# EAGLE design led_ring (EAGLE 8.5.2)
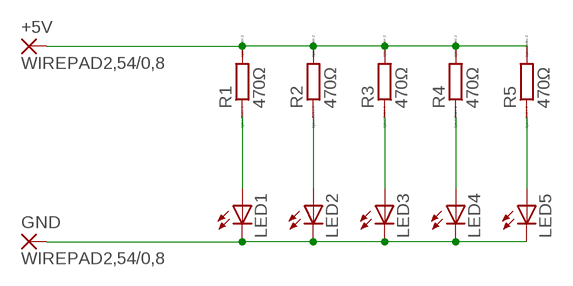
[diagram p0: schematic, sheet 1]

## Parts
+5V  WIREPAD2,54/0,8  [2,54/0,8]
GND  WIREPAD2,54/0,8  [2,54/0,8]
LED1  LED5MM  [LED5MM]
LED2  LED5MM  [LED5MM]
LED3  LED5MM  [LED5MM]
LED4  LED5MM  [LED5MM]
LED5  LED5MM  [LED5MM]
R1  470Ω  R0204/7  [0204/7]
R2  470Ω  R0204/7  [0204/7]
R3  470Ω  R0204/7  [0204/7]
R4  470Ω  R0204/7  [0204/7]
R5  470Ω  R0204/7  [0204/7]

## Nets
N$1: LED1.A R1.1
N$2: LED2.A R2.1
N$3: LED3.A R3.1
N$4: LED4.A R4.1
N$5: LED5.A R5.1
N$6: +5V.1(P) R1.2 R2.2 R3.2 R4.2 R5.2
N$7: GND.1(P) LED1.K(C) LED2.K(C) LED3.K(C) LED4.K(C) LED5.K(C)

## Library data of the parts
+5V GND = wirepad:WIREPAD: Wire PAD connect wire on PCB
LED1-LED5 = led:LED: LED OSRAM: - CHIPLED LG R971, LG N971, LY N971, LG Q971, LY Q971, LO R971, LY R971 LH N974, LH R974 LS Q976, LO Q976, LY Q976 LO Q996 - Hyper CHIPLED LW Q18S LB Q993, LB Q99A, LB R99A - SideLED LS A670, LO A670, LY A670, LG A670, LP A670 LB A673, LV A673, LT A673, LW A673 LH A674 LY A675 LS A676, LA A676, LO A676, LY A676, LW A676 LS A679, LY A679, LG A679 - Hyper Micro SIDELED® LS Y876, LA Y876, LO Y876, LY Y876 LT Y87S - SmartLED LW L88C, LW L88S LB L89C, LB L89S, LG L890 LS L89K, LO L89K, LY L89K LS L896, LA L896, LO L896, LY L896 - TOPLED LS T670, LO T670, LY T670, LG T670, LP T670 LSG T670, LSP T670, LSY T670, LOP T670, LYG T670 LG T671, LOG T671, LSG T671 LB T673, LV T673, LT T673, LW T673 LH T674 LS T676, LA T676, LO T676, LY T676, LB T676, LH T676, LSB T676, LW T676 LB T67C, LV T67C, LT T67C, LS T67K, LO T67K, LY T67K, LW E67C LS E67B, LA E67B, LO E67B, LY E67B, LB E67C, LV E67C, LT E67C LW T67C LS T679, LY T679, LG T679 LS T770, LO T770, LY T770, LG T770, LP T770 LB T773, LV T773, LT T773, LW T773 LH T774 LS E675, LA E675, LY E675, LS T675 LS T776, LA T776, LO T776, LY T776, LB T776 LHGB T686 LT T68C, LB T68C - Hyper Mini TOPLED® LB M676 - Mini TOPLED Santana® LG M470 LS M47K, LO M47K, LY M47K Source: http://www.osram.convergy.de LUXEON: - LUMILED® LXK2-PW12-R00, LXK2-PW12-S00, LXK2-PW14-U00, LXK2-PW14-V00 LXK2-PM12-R00, LXK2-PM12-S00, LXK2-PM14-U00 LXK2-PE12-Q00, LXK2-PE12-R00, LXK2-PE12-S00, LXK2-PE14-T00, LXK2-PE14-U00 LXK2-PB12-K00, LXK2-PB12-L00, LXK2-PB12-M00, LXK2-PB14-N00, LXK2-PB14-P00, LXK2-PB14-Q00 LXK2-PR12-L00, LXK2-PR12-M00, LXK2-PR14-Q00, LXK2-PR14-R00 LXK2-PD12-Q00, LXK2-PD12-R00, LXK2-PD12-S00 LXK2-PH12-R00, LXK2-PH12-S00 LXK2-PL12-P00, LXK2-PL12-Q00, LXK2-PL12-R00 Source: www.luxeon.com KINGBRIGHT: KA-3528ASYC Source: www.kingbright.com
R1-R5 = eagle-ltspice:R: RESISTOR, European symbol; SPICEMODEL: NONE; SPICEPREFIX: R

## Board
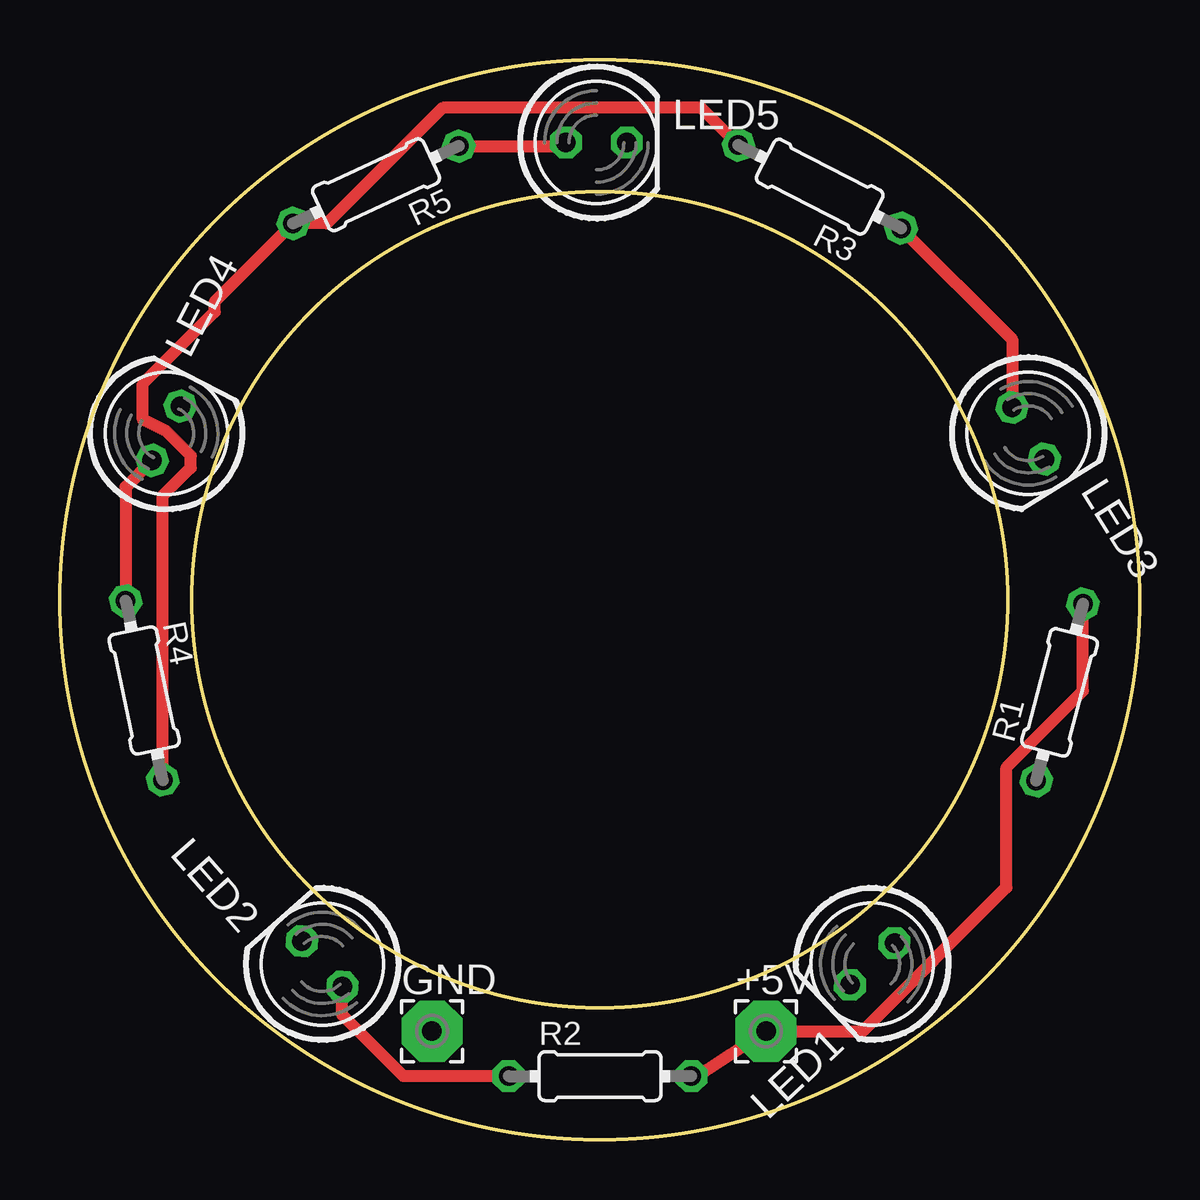
[diagram p1: board, top side]
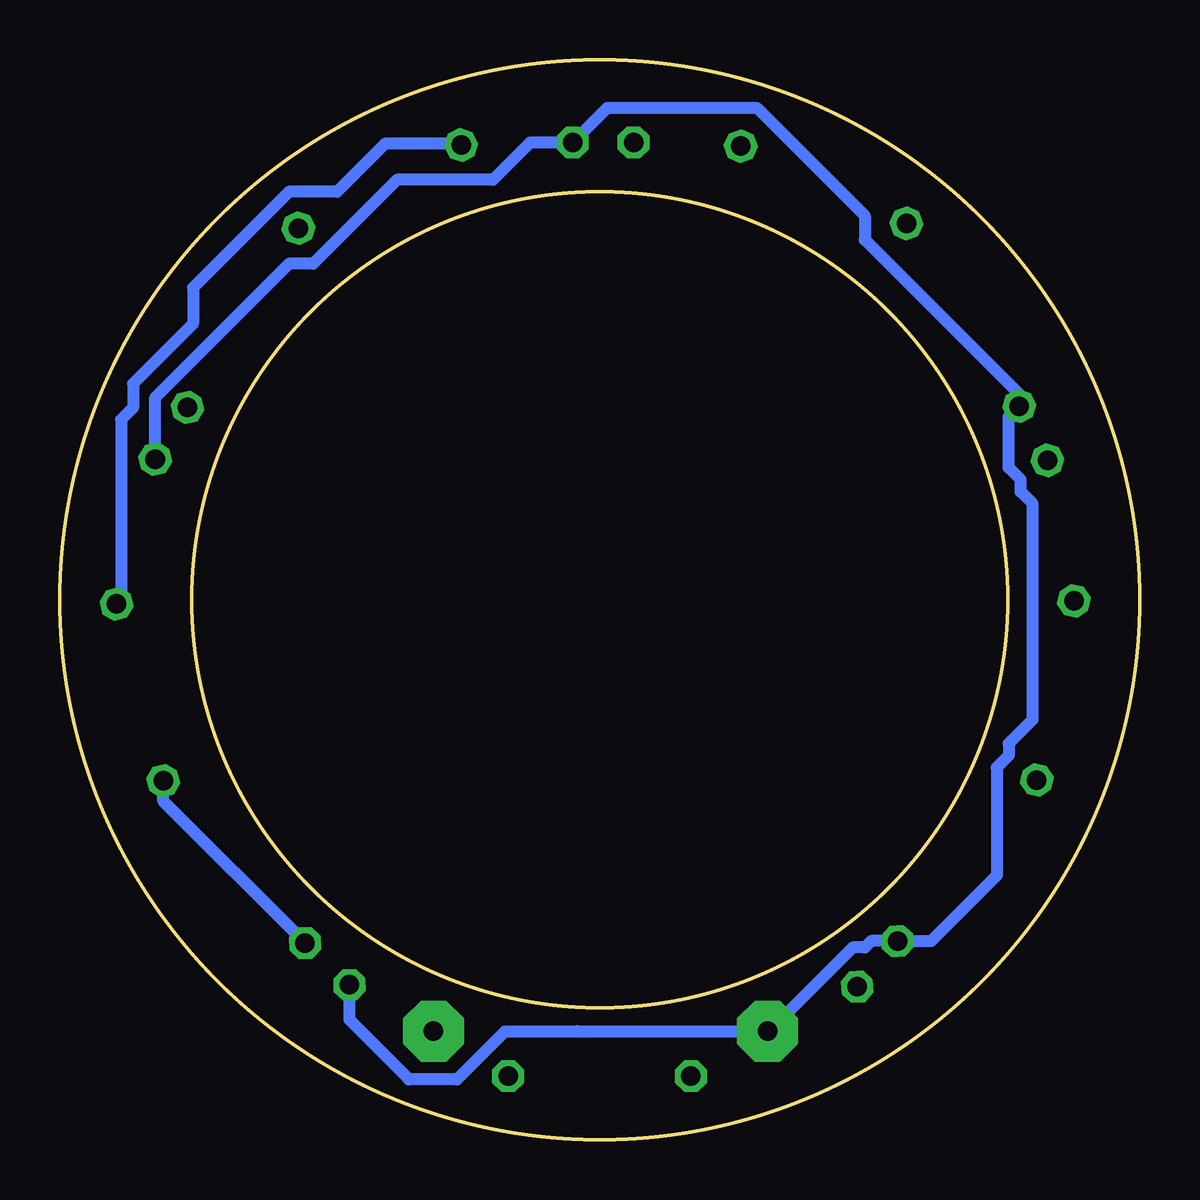
[diagram p2: board, bottom side, seen from below]

Size 45 x 45 mm. Coordinates in mm from the lower left corner, seen from the top.
Outline: circle at 22.5,22.5 radius 17
Outline: circle at 22.5,22.5 radius 22.5
Copper layers (1*16): Top 0.035mm / dielectric 1.5mm / Bottom 0.035mm
Design rules "alan": minimum track width 10mil, minimum drill 0.8mm, track to track 10mil, track to pad 10mil, pad to pad 10mil, via to via 10mil, smd to smd 10mil, copper to edge 20mil, drill to drill 20mil, minimum pad ring 10mil, minimum via ring 8mil, stop-mask expansion 4mil, vias tented up to drill 0mil, thermal gap 10mil

### Footprints (pad centres in the part's own frame; a part is rotated, then mirrored left to right if it is on the bottom)
2,54/0,8 = drill 0.813 pad 2.54 octagon: 1 0,0
LED5MM = drill 0.813 octagon: A -1.27,0; K 1.27,0
0204/7 = drill 0.813 octagon: 1 -3.81,0; 2 3.81,0

### Placement (x,y rotation side)
+5V  29.43,4.52 0 top
GND  15.51,4.52 0 top
LED1  33.86,7.32 223.2 top
LED2  10.93,7.32 131.4 top
LED3  40.36,29.44 301.9 top
LED4  4.43,29.44 62.5 top
LED5  22.36,41.56 0 top
R1  41.67,18.64 75.2 top
R2  22.51,2.64 0 top
R3  31.67,39.72 152.9 top
R4  3.51,18.72 281.7 top
R5  13.17,39.8 205 top

### Tracks (layer width: path | path; a pad name or v marks a point on that pad's centre or on a via)
N$1
  Bottom 0.508: LED1.A 40.7,14.1 R1.1
N$2
  Top 0.508: R2.1 14.32,2.64 11.77,5.19 LED2.A
N$3
  Top 0.508: R3.1 39.69,33.36 LED3.A
N$4
  Top 0.508: LED4.A 2.74,27.21 R4.1
N$5
  Top 0.508: R5.1 20.94,41.41 LED5.A
N$6
  Top 0.508: R2.2 26.55,2.64 +5V.1 33.46,4.52 39.45,10.51 39.45,15.51 42.64,18.7 R1.2 | R3.2 26.72,43.01 15.95,43.01 11.13,38.19 R5.2 6.45,34.92 6.45,34.51 3.45,31.51 3.45,30.01 4.45,29.51 5.45,28.51 5.45,28.01 4.28,26.84 R4.2
  Bottom 0.508: R3.2 28.33,41.51 31.45,41.51 33.45,39.51 35.45,39.51 39.45,35.51 39.45,34.01 41.95,31.51 41.95,30.51 42.45,30.01 42.45,22.52 R1.2
N$7
  Bottom 0.508: LED3.K 41.03,30.93 35.45,36.51 34.45,36.51 30.95,40.01 26.95,40.01 25.4,41.56 LED5.K 22.18,43.01 15.95,43.01 11.45,38.51 11.45,37.51 5.02,31.08 LED4.K 5.45,30.13 5.45,28.01 4.95,27.51 4.95,27.01 4.45,26.51 4.45,17.51 5.45,16.51 5.45,16.01 5.95,15.51 5.95,11.01 8.69,8.27 LED2.K 11.19,8.27 11.45,8.01 11.95,8.01 15.44,4.52 GND.1 23.44,4.52 23.45,4.51 26.45,4.51 28.45,2.51 30.45,2.51 32.93,4.99 LED1.K